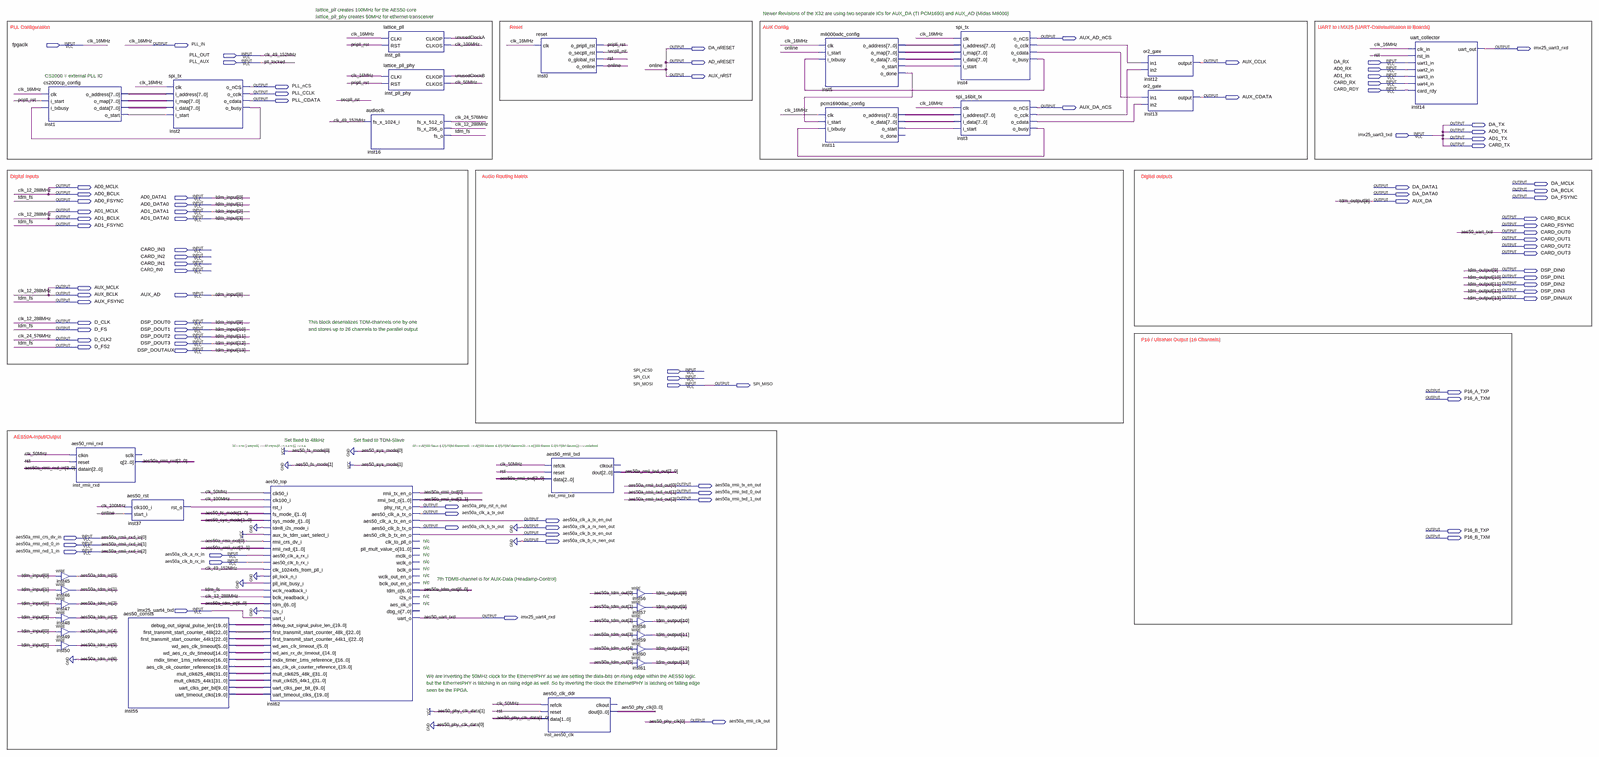
[diagram p0: schematic sheet, whole]
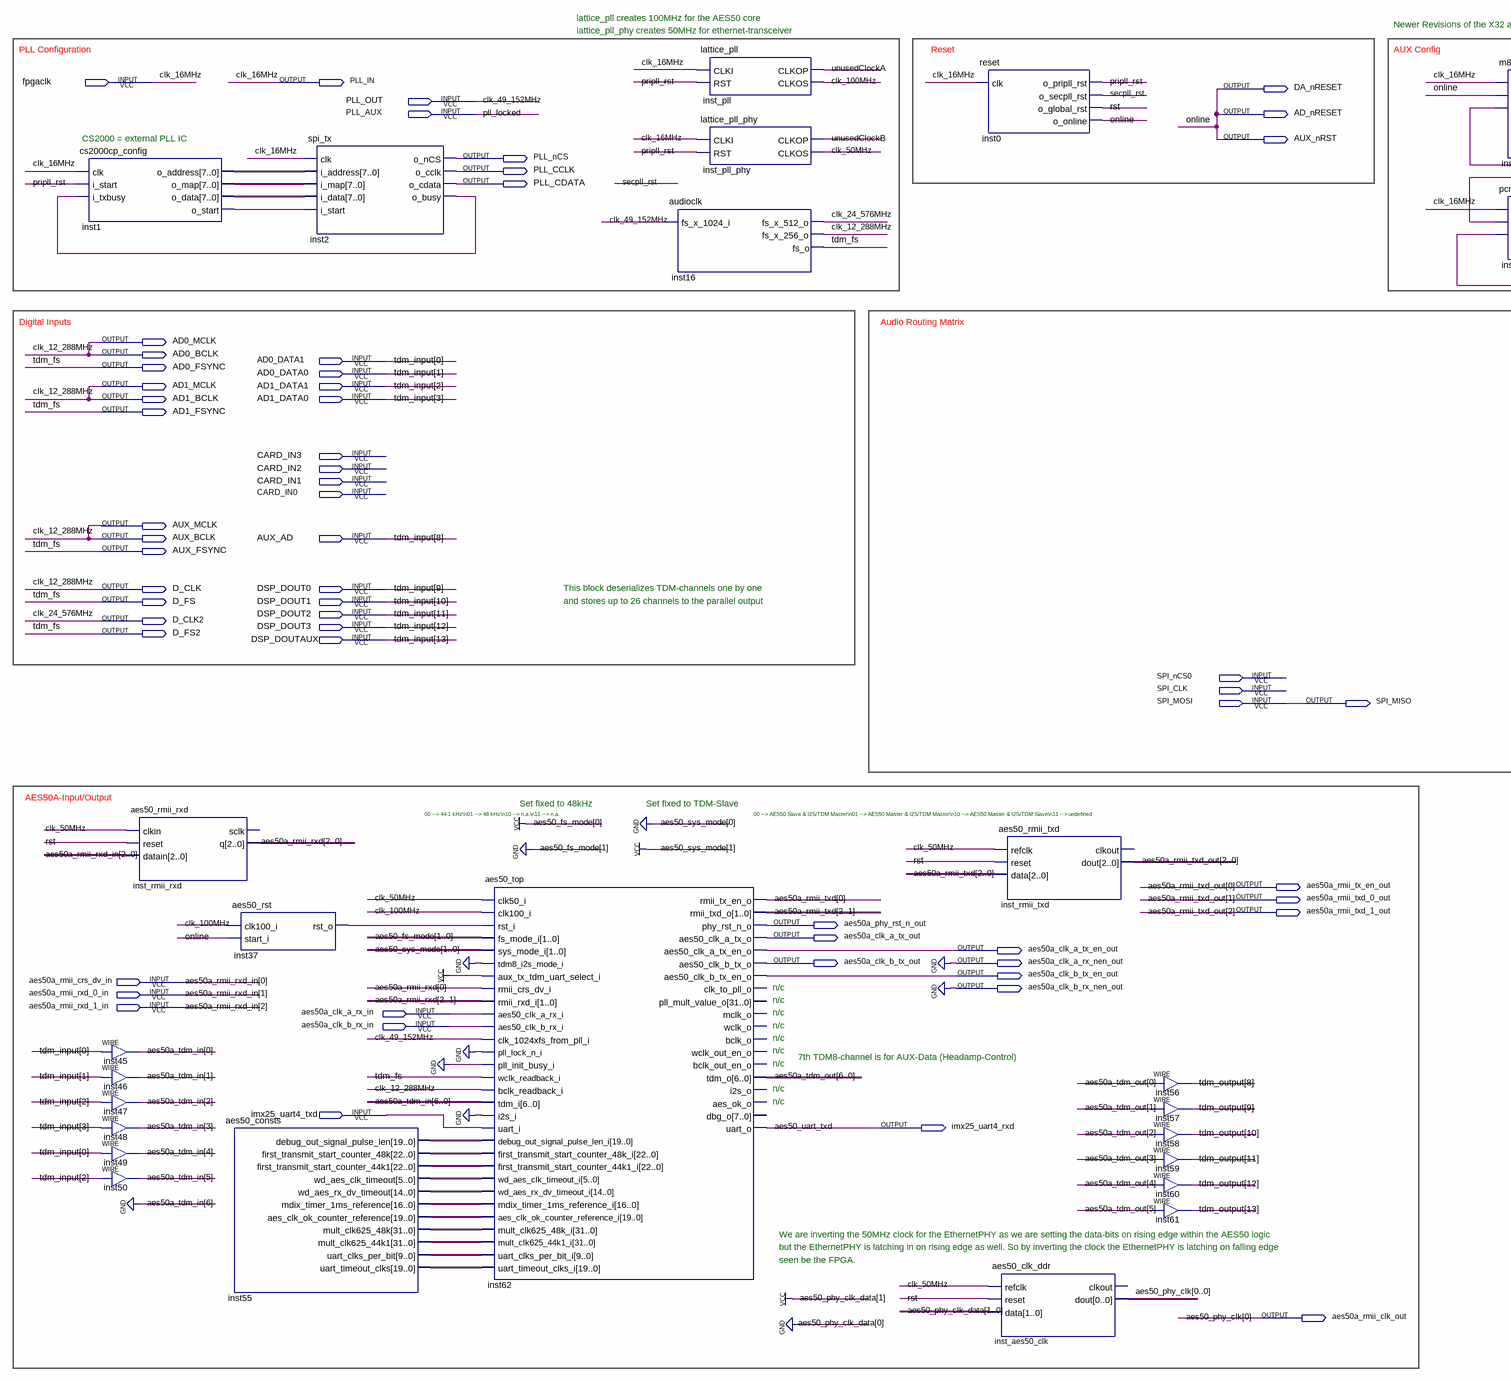
[diagram p1: schematic sheet, left part]
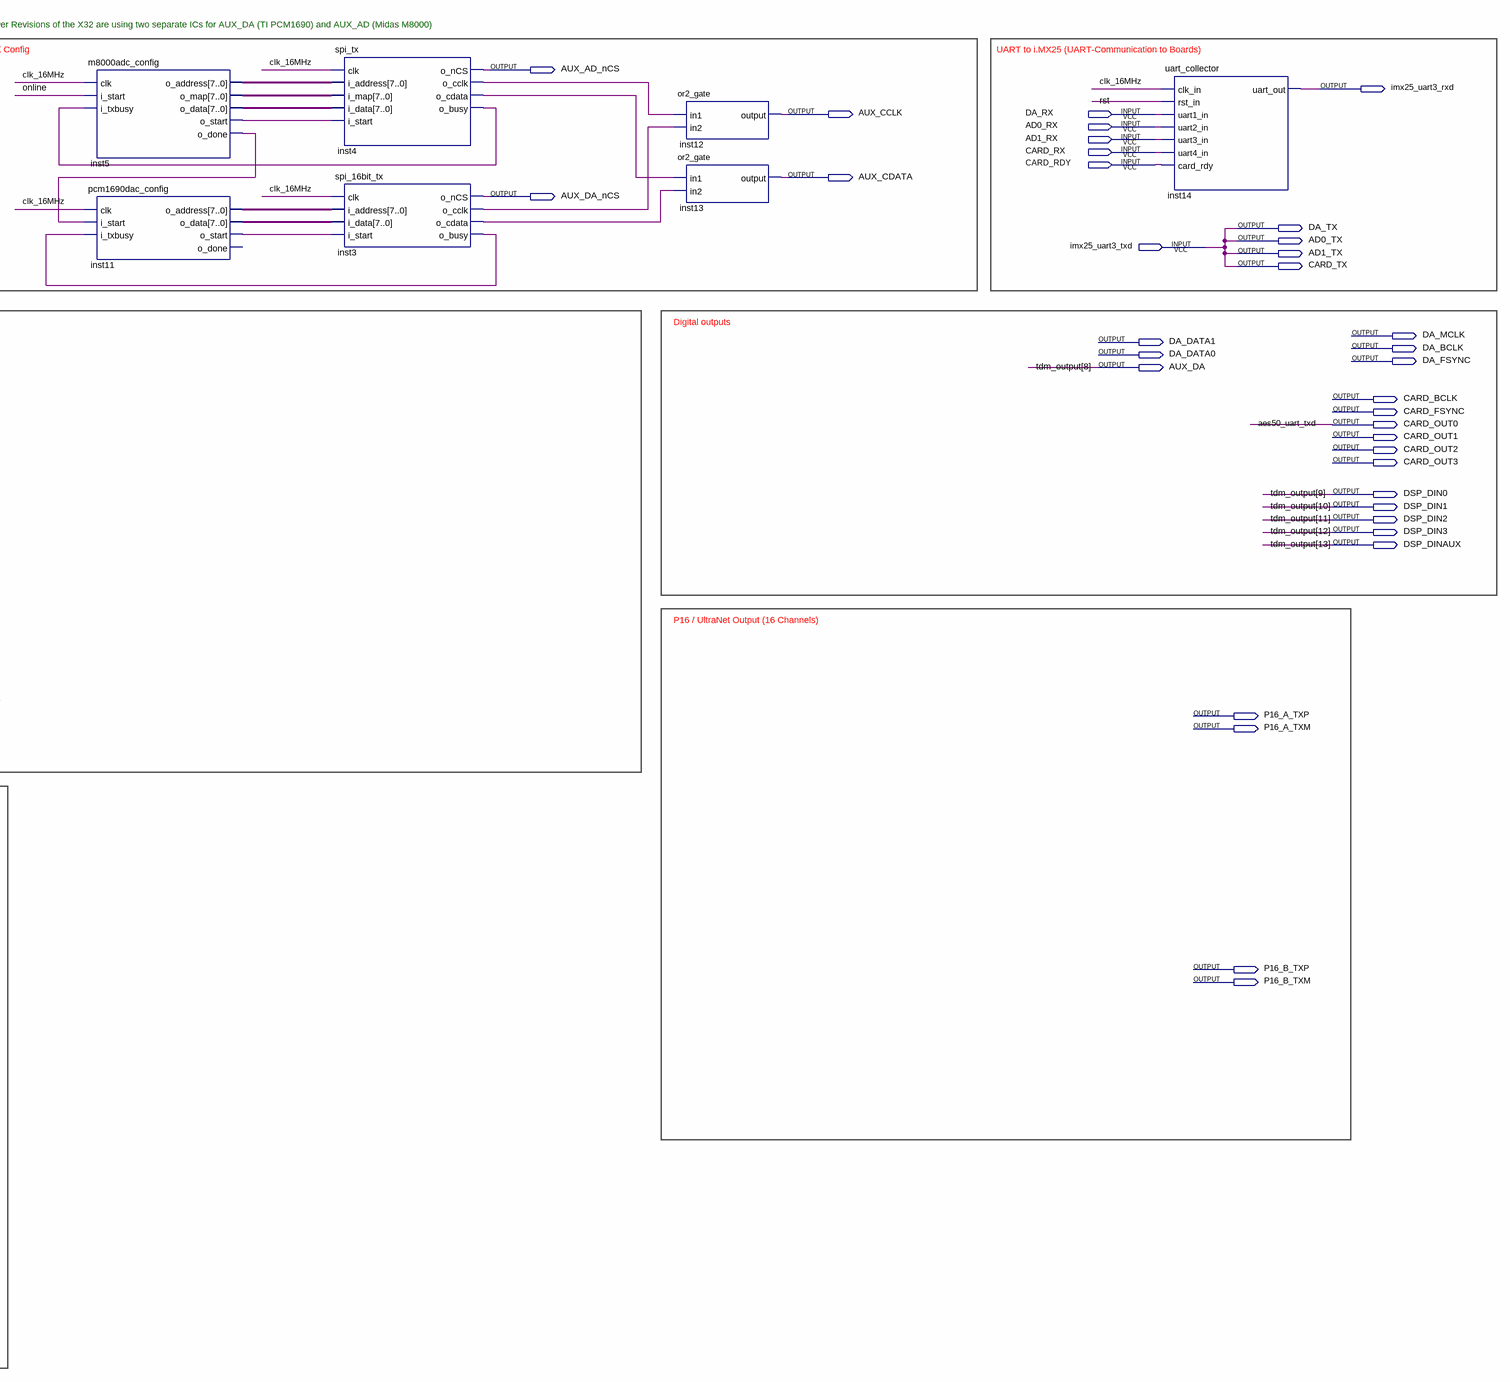
[diagram p2: schematic sheet, right part]
// Quartus schematic main_lattice_aes50only.bdf as structural Verilog: 31 symbols, 95 pins
module main_lattice_aes50only (
  input  fpgaclk,
  input  PLL_OUT,
  input  PLL_AUX,
  input  DA_RX,
  input  AD0_RX,
  input  AD1_RX,
  input  CARD_RX,
  input  CARD_RDY,
  input  imx25_uart3_txd,
  input  AD0_DATA1,
  input  AD0_DATA0,
  input  AD1_DATA1,
  input  AD1_DATA0,
  input  CARD_IN3,
  input  CARD_IN2,
  input  CARD_IN1,
  input  CARD_IN0,
  input  AUX_AD,
  input  DSP_DOUT0,
  input  DSP_DOUT1,
  input  DSP_DOUT2,
  input  DSP_DOUT3,
  input  DSP_DOUTAUX,
  input  SPI_nCS0,
  input  SPI_CLK,
  input  SPI_MOSI,
  input  aes50a_rmii_crs_dv_in,
  input  aes50a_rmii_rxd_0_in,
  input  aes50a_rmii_rxd_1_in,
  input  aes50a_clk_a_rx_in,
  input  aes50a_clk_b_rx_in,
  input  imx25_uart4_txd,
  output AUX_AD_nCS,
  output PLL_IN,
  output DA_nRESET,
  output imx25_uart3_rxd,
  output AD_nRESET,
  output AUX_CCLK,
  output AUX_nRST,
  output PLL_nCS,
  output PLL_CCLK,
  output AUX_CDATA,
  output PLL_CDATA,
  output AUX_DA_nCS,
  output DA_TX,
  output AD0_TX,
  output AD1_TX,
  output CARD_TX,
  output DA_MCLK,
  output AD0_MCLK,
  output DA_DATA1,
  output DA_BCLK,
  output AD0_BCLK,
  output DA_DATA0,
  output DA_FSYNC,
  output AD0_FSYNC,
  output AUX_DA,
  output AD1_MCLK,
  output AD1_BCLK,
  output CARD_BCLK,
  output AD1_FSYNC,
  output CARD_FSYNC,
  output CARD_OUT0,
  output CARD_OUT1,
  output CARD_OUT2,
  output CARD_OUT3,
  output DSP_DIN0,
  output DSP_DIN1,
  output DSP_DIN2,
  output AUX_MCLK,
  output DSP_DIN3,
  output AUX_BCLK,
  output DSP_DINAUX,
  output AUX_FSYNC,
  output D_CLK,
  output D_FS,
  output D_CLK2,
  output D_FS2,
  output SPI_MISO,
  output P16_A_TXP,
  output P16_A_TXM,
  output aes50a_rmii_tx_en_out,
  output aes50a_rmii_txd_0_out,
  output aes50a_rmii_txd_1_out,
  output aes50a_phy_rst_n_out,
  output aes50a_clk_a_tx_out,
  output aes50a_clk_a_tx_en_out,
  output aes50a_clk_b_tx_out,
  output aes50a_clk_a_rx_nen_out,
  output P16_B_TXP,
  output aes50a_clk_b_tx_en_out,
  output P16_B_TXM,
  output aes50a_clk_b_rx_nen_out,
  output imx25_uart4_rxd,
  output aes50a_rmii_clk_out
);

  wire clk_50MHz, clk_100MHz, inst1_o_start, inst2_o_busy, inst3_o_busy, inst3_o_cclk, inst3_o_cdata,
       inst4_o_busy, inst4_o_cclk, inst4_o_cdata, inst5_o_done, inst5_o_start, inst11_o_start, inst37_rst_o,
       pripll_rst, rst, secpll_rst, unusedClockA, unusedClockB;
  wire [2:0] aes50a_rmii_rxd, aes50a_rmii_txd;
  wire [5:0] aes50a_tdm_in, inst55_wd_aes_clk_timeout;
  wire [6:0] aes50a_tdm_out;
  wire [7:0] inst1_o_address, inst1_o_data, inst1_o_map, inst5_o_address, inst5_o_data, inst5_o_map,
       inst11_o_address, inst11_o_data;
  wire [9:0] inst55_uart_clks_per_bit;
  wire [14:0] inst55_wd_aes_rx_dv_timeout;
  wire [16:0] inst55_mdix_timer_1ms_reference;
  wire [19:0] inst55_aes_clk_ok_counter_reference, inst55_debug_out_signal_pulse_len,
       inst55_uart_timeout_clks;
  wire [22:0] inst55_first_transmit_start_counter_44k1, inst55_first_transmit_start_counter_48k;
  wire [31:0] inst55_mult_clk625_44k1, inst55_mult_clk625_48k;

  cs2000cp_config inst1 (
    .clk(fpgaclk), .i_start(pripll_rst), .i_txbusy(inst2_o_busy), .o_address(inst1_o_address),
    .o_map(inst1_o_map), .o_data(inst1_o_data), .o_start(inst1_o_start));
  aes50_rmii_rxd inst_rmii_rxd (
    .clkin(clk_50MHz), .reset(rst),
    .datain({aes50a_rmii_rxd_1_in, aes50a_rmii_rxd_0_in, aes50a_rmii_crs_dv_in}), .q(aes50a_rmii_rxd));  // open: sclk
  assign aes50a_tdm_in[0] = AD0_DATA1;  // WIRE inst45
  assign aes50a_tdm_in[1] = AD0_DATA0;  // WIRE inst46
  assign aes50a_tdm_in[2] = AD1_DATA1;  // WIRE inst47
  assign aes50a_tdm_in[3] = AD1_DATA0;  // WIRE inst48
  assign aes50a_tdm_in[4] = AD0_DATA1;  // WIRE inst49
  assign aes50a_tdm_in[5] = AD1_DATA1;  // WIRE inst50
  aes50_rst inst37 (.clk100_i(clk_100MHz), .start_i(AD_nRESET), .rst_o(inst37_rst_o));
  aes50_consts inst55 (
    .debug_out_signal_pulse_len(inst55_debug_out_signal_pulse_len),
    .first_transmit_start_counter_48k(inst55_first_transmit_start_counter_48k),
    .first_transmit_start_counter_44k1(inst55_first_transmit_start_counter_44k1),
    .wd_aes_clk_timeout(inst55_wd_aes_clk_timeout), .wd_aes_rx_dv_timeout(inst55_wd_aes_rx_dv_timeout),
    .mdix_timer_1ms_reference(inst55_mdix_timer_1ms_reference),
    .aes_clk_ok_counter_reference(inst55_aes_clk_ok_counter_reference),
    .mult_clk625_48k(inst55_mult_clk625_48k), .mult_clk625_44k1(inst55_mult_clk625_44k1),
    .uart_clks_per_bit(inst55_uart_clks_per_bit), .uart_timeout_clks(inst55_uart_timeout_clks));
  spi_tx inst2 (
    .clk(fpgaclk), .i_address(inst1_o_address), .i_map(inst1_o_map), .i_data(inst1_o_data),
    .i_start(inst1_o_start), .o_nCS(PLL_nCS), .o_cclk(PLL_CCLK), .o_cdata(PLL_CDATA), .o_busy(inst2_o_busy));
  aes50_top inst62 (
    .clk50_i(clk_50MHz), .clk100_i(clk_100MHz), .rst_i(inst37_rst_o), .fs_mode_i(2'b01), .sys_mode_i(2'b10),
    .tdm8_i2s_mode_i(1'b0), .aux_tx_tdm_uart_select_i(1'b1), .rmii_crs_dv_i(aes50a_rmii_rxd[0]),
    .rmii_rxd_i(aes50a_rmii_rxd[2:1]), .aes50_clk_a_rx_i(aes50a_clk_a_rx_in),
    .aes50_clk_b_rx_i(aes50a_clk_b_rx_in), .clk_1024xfs_from_pll_i(PLL_OUT), .pll_lock_n_i(1'b0),
    .pll_init_busy_i(1'b0), .wclk_readback_i(AD0_FSYNC), .bclk_readback_i(AD0_BCLK),
    .tdm_i({1'b0, aes50a_tdm_in}), .i2s_i(1'b0), .uart_i(imx25_uart4_txd),
    .debug_out_signal_pulse_len_i(inst55_debug_out_signal_pulse_len),
    .first_transmit_start_counter_48k_i(inst55_first_transmit_start_counter_48k),
    .first_transmit_start_counter_44k1_i(inst55_first_transmit_start_counter_44k1),
    .wd_aes_clk_timeout_i(inst55_wd_aes_clk_timeout), .wd_aes_rx_dv_timeout_i(inst55_wd_aes_rx_dv_timeout),
    .mdix_timer_1ms_reference_i(inst55_mdix_timer_1ms_reference),
    .aes_clk_ok_counter_reference_i(inst55_aes_clk_ok_counter_reference),
    .mult_clk625_48k_i(inst55_mult_clk625_48k), .mult_clk625_44k1_i(inst55_mult_clk625_44k1),
    .uart_clks_per_bit_i(inst55_uart_clks_per_bit), .uart_timeout_clks_i(inst55_uart_timeout_clks),
    .rmii_tx_en_o(aes50a_rmii_txd[0]), .rmii_txd_o(aes50a_rmii_txd[2:1]), .phy_rst_n_o(aes50a_phy_rst_n_out),
    .aes50_clk_a_tx_o(aes50a_clk_a_tx_out), .aes50_clk_a_tx_en_o(aes50a_clk_a_tx_en_out),
    .aes50_clk_b_tx_o(aes50a_clk_b_tx_out), .aes50_clk_b_tx_en_o(aes50a_clk_b_tx_en_out),
    .tdm_o(aes50a_tdm_out), .uart_o(CARD_OUT0));  // open: clk_to_pll_o, pll_mult_value_o, mclk_o, wclk_o, bclk_o, wclk_out_en_o, bclk_out_en_o, i2s_o, aes_ok_o, dbg_o
  audioclk inst16 (.fs_x_1024_i(PLL_OUT), .fs_x_512_o(D_CLK2), .fs_x_256_o(AD0_BCLK), .fs_o(AD0_FSYNC));
  lattice_pll inst_pll (.CLKI(fpgaclk), .RST(pripll_rst), .CLKOP(unusedClockA), .CLKOS(clk_100MHz));
  lattice_pll_phy inst_pll_phy (.CLKI(fpgaclk), .RST(pripll_rst), .CLKOP(unusedClockB), .CLKOS(clk_50MHz));
  reset inst0 (
    .clk(fpgaclk), .o_pripll_rst(pripll_rst), .o_secpll_rst(secpll_rst), .o_global_rst(rst),
    .o_online(AD_nRESET));
  aes50_clk_ddr inst_aes50_clk (
    .refclk(clk_50MHz), .reset(rst), .data(2'b10), .dout(aes50a_rmii_clk_out));  // open: clkout
  aes50_rmii_txd inst_rmii_txd (
    .refclk(clk_50MHz), .reset(rst), .data(aes50a_rmii_txd),
    .dout({aes50a_rmii_txd_1_out, aes50a_rmii_txd_0_out, aes50a_rmii_tx_en_out}));  // open: clkout
  assign AUX_DA = aes50a_tdm_out[0];  // WIRE inst56
  assign DSP_DIN0 = aes50a_tdm_out[1];  // WIRE inst57
  assign DSP_DIN1 = aes50a_tdm_out[2];  // WIRE inst58
  assign DSP_DIN2 = aes50a_tdm_out[3];  // WIRE inst59
  assign DSP_DIN3 = aes50a_tdm_out[4];  // WIRE inst60
  assign DSP_DINAUX = aes50a_tdm_out[5];  // WIRE inst61
  m8000adc_config inst5 (
    .clk(fpgaclk), .i_start(AD_nRESET), .i_txbusy(inst4_o_busy), .o_address(inst5_o_address),
    .o_map(inst5_o_map), .o_data(inst5_o_data), .o_start(inst5_o_start), .o_done(inst5_o_done));
  pcm1690dac_config inst11 (
    .clk(fpgaclk), .i_start(inst5_o_done), .i_txbusy(inst3_o_busy), .o_address(inst11_o_address),
    .o_data(inst11_o_data), .o_start(inst11_o_start));  // open: o_done
  spi_tx inst4 (
    .clk(fpgaclk), .i_address(inst5_o_address), .i_map(inst5_o_map), .i_data(inst5_o_data),
    .i_start(inst5_o_start), .o_nCS(AUX_AD_nCS), .o_cclk(inst4_o_cclk), .o_cdata(inst4_o_cdata),
    .o_busy(inst4_o_busy));
  spi_16bit_tx inst3 (
    .clk(fpgaclk), .i_address(inst11_o_address), .i_data(inst11_o_data), .i_start(inst11_o_start),
    .o_nCS(AUX_DA_nCS), .o_cclk(inst3_o_cclk), .o_cdata(inst3_o_cdata), .o_busy(inst3_o_busy));
  or2_gate inst12 (.in1(inst4_o_cclk), .in2(inst3_o_cclk), .\output (AUX_CCLK));
  or2_gate inst13 (.in1(inst4_o_cdata), .in2(inst3_o_cdata), .\output (AUX_CDATA));
  uart_collector inst14 (
    .clk_in(fpgaclk), .rst_in(rst), .uart1_in(DA_RX), .uart2_in(AD0_RX), .uart3_in(AD1_RX),
    .uart4_in(CARD_RX), .card_rdy(CARD_RDY), .uart_out(imx25_uart3_rxd));

  assign AD0_MCLK = AD0_BCLK;
  assign AD0_TX = imx25_uart3_txd;
  assign AD1_BCLK = AD0_BCLK;
  assign AD1_FSYNC = AD0_FSYNC;
  assign AD1_MCLK = AD0_BCLK;
  assign AD1_TX = imx25_uart3_txd;
  assign aes50a_clk_a_rx_nen_out = 1'b0;
  assign aes50a_clk_b_rx_nen_out = 1'b0;
  assign AUX_BCLK = AD0_BCLK;
  assign AUX_FSYNC = AD0_FSYNC;
  assign AUX_MCLK = AD0_BCLK;
  assign AUX_nRST = AD_nRESET;
  assign CARD_TX = imx25_uart3_txd;
  assign D_CLK = AD0_BCLK;
  assign D_FS = AD0_FSYNC;
  assign D_FS2 = AD0_FSYNC;
  assign DA_nRESET = AD_nRESET;
  assign DA_TX = imx25_uart3_txd;
  assign imx25_uart4_rxd = CARD_OUT0;
  assign PLL_IN = fpgaclk;
  assign SPI_MISO = SPI_MOSI;

  // Other names for the same wires on the sheet: clk_12_288MHz = AD0_BCLK; aes50_phy_clk[0] = aes50a_rmii_clk_out;
  //   aes50_uart_txd = CARD_OUT0;
  //   aes50a_rmii_rxd_in[2:0] = {aes50a_rmii_rxd_1_in, aes50a_rmii_rxd_0_in, aes50a_rmii_crs_dv_in};
  //   aes50a_rmii_txd_out[2:0] = {aes50a_rmii_txd_1_out, aes50a_rmii_txd_0_out, aes50a_rmii_tx_en_out};
  //   clk_16MHz = fpgaclk; clk_24_576MHz = D_CLK2; clk_49_152MHz = PLL_OUT; online = AD_nRESET; pll_locked = PLL_AUX;
  //   tdm_fs = AD0_FSYNC;
  //   tdm_input (some bits) = {DSP_DOUTAUX, DSP_DOUT3, DSP_DOUT2, DSP_DOUT1, DSP_DOUT0, AUX_AD, AD1_DATA0, AD1_DATA1, AD0_DATA0, AD0_DATA1};
  //   tdm_output[13:8] = {DSP_DINAUX, DSP_DIN3, DSP_DIN2, DSP_DIN1, DSP_DIN0, AUX_DA}

  // Notes on the sheet:
  //   lattice_pll creates 100MHz for the AES50 core
  //   Newer Revisions of the X32 are using two separate ICs for AUX_DA (TI PCM1690) and AUX_AD (Midas M8000)
  //   lattice_pll_phy creates 50MHz for ethernet-transceiver
  //   PLL Configuration
  //   Reset
  //   AUX Config
  //   UART to i.MX25 (UART-Communication to Boards)
  //   CS2000 = external PLL IC
  //   Digital Inputs
  //   Audio Routing Matrix
  //   Digital outputs
  //   This block deserializes TDM-channels one by one
  //   and stores up to 26 channels to the parallel output
  //   P16 / UltraNet Output (16 Channels)
  //   AES50A-Input/Output
  //   Set fixed to 48kHz
  //   Set fixed to TDM-Slave
  //   00 --> 44.1 kHz\n01 --> 48 kHz\n10 --> n.a.\n11 --> n.a.
  //   00 --> AES50 Slave & I2S/TDM Master\n01 --> AES50 Master & I2S/TDM Master\n10 --> AES50 Master & I2S/TDM Slave\n11 --> undefined
  //   n/c
  //   n/c
  //   n/c
  //   n/c
  //   n/c
  //   n/c
  //   7th TDM8-channel is for AUX-Data (Headamp-Control)
  //   n/c
  //   n/c
  //   n/c
  //   We are inverting the 50MHz clock for the EthernetPHY as we are setting the data-bits on rising edge within the AES50 logic
  //   but the EthernetPHY is latching in on rising edge as well. So by inverting the clock the EthernetPHY is latching on falling edge
  //   seen be the FPGA.
endmodule
